# EAGLE design Adafruit 1.3in Color TFT Bonnet (EAGLE 9.5.0)
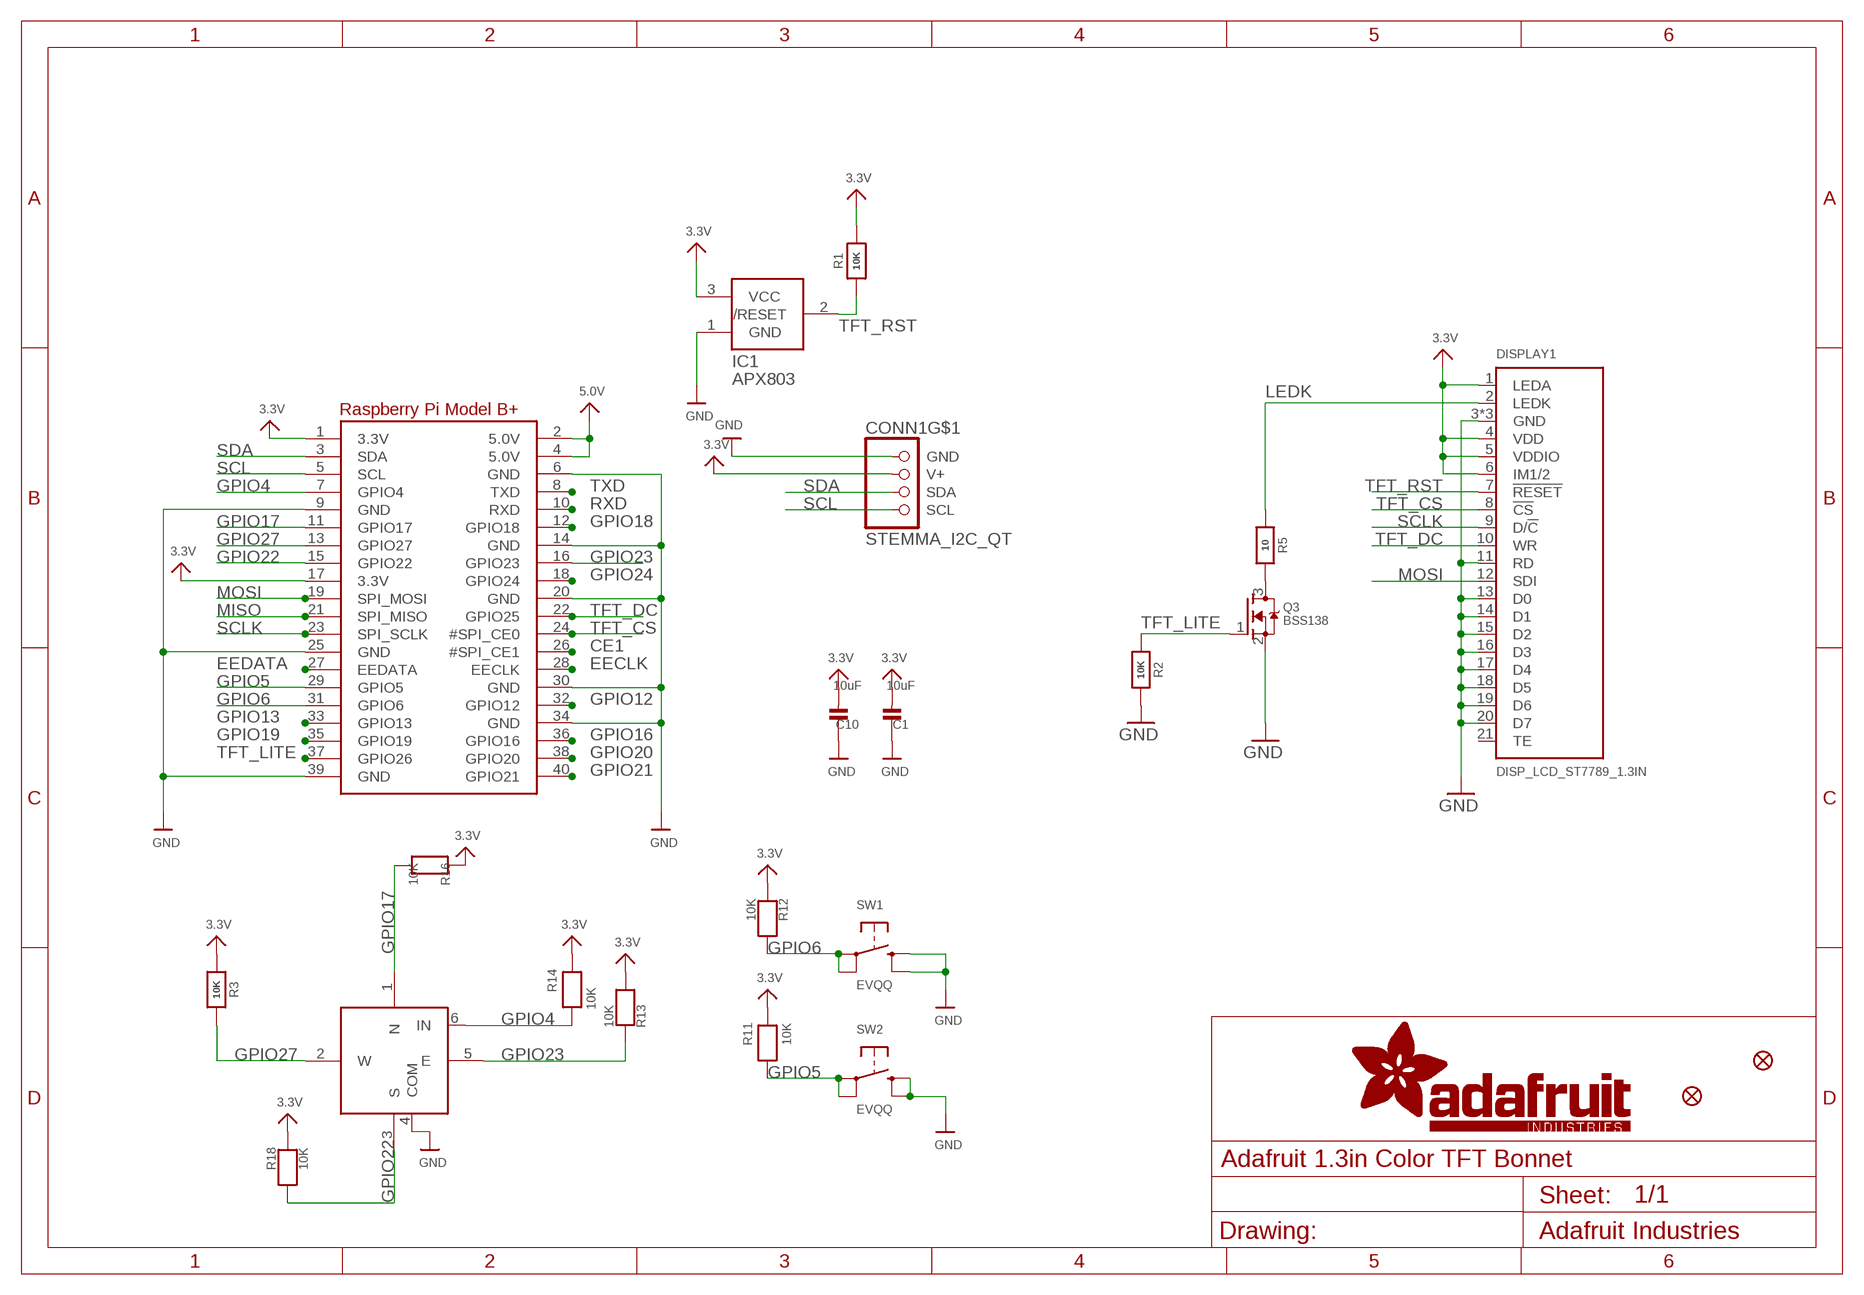
[diagram p0: schematic, sheet 1]

## Parts
C1  10uF  CAP_CERAMIC0805-NOOUTLINE  [0805-NO]
C10  10uF  CAP_CERAMIC0805-NOOUTLINE  [0805-NO]
CONN1  STEMMA_I2C_QT  [JST_SH4]
DISPLAY1  DISP_LCD_ST7789_1.3IN  [TFT_1.3IN_240X240_24P]
FID1  FIDUCIAL_1MM  [FIDUCIAL_1MM]
FID2  FIDUCIAL_1MM  [FIDUCIAL_1MM]
IC1  APX803  AXP083-SAG  [SOT23]
Q3  BSS138  MOSFET-NWIDE  [SOT23-WIDE]
R1  10K  RESISTOR0805_NOOUTLINE  [0805-NO]
R2  10K  RESISTOR_0603_NOOUT  [0603-NO]
R3  10K  RESISTOR0805_NOOUTLINE  [0805-NO]
R5  10  RESISTOR_0603_NOOUT  [0603-NO]
R11  10K  RESISTOR0805_NOOUTLINE  [0805-NO]
R12  10K  RESISTOR0805_NOOUTLINE  [0805-NO]
R13  10K  RESISTOR0805_NOOUTLINE  [0805-NO]
R14  10K  RESISTOR0805_NOOUTLINE  [0805-NO]
R16  10K  RESISTOR0805_NOOUTLINE  [0805-NO]
R18  10K  RESISTOR0805_NOOUTLINE  [0805-NO]
RPI1  RASPBERRYPI_BPLUS_BONNETSMT  [PI_BONNET_SMT]
SW1  EVQQ  SWITCH_TACT_SMT_6MM  [6MMX6MM_TACTILE_SMT]
SW2  EVQQ  SWITCH_TACT_SMT_6MMSMALL  [6MM_SMT]
SW3  NAVSWITCHSKQUABAUE010  [SKQUBAE010]

## Nets
3.3V: C1.2 C10.2 CONN1.2(V+) DISPLAY1.1(LEDA) DISPLAY1.4(VDD) DISPLAY1.5(VDDIO) DISPLAY1.6(IM1/2) IC1.3(VCC) R1.2 R3.2 R11.2 R12.2 R13.2 R14.2 R16.1 R18.1 RPI1.1(3.3V) RPI1.17(3.3V)
5.0V: RPI1.2(5.0V) RPI1.4(5.0V)
CE1: RPI1.26(#SPI_CE1)
EECLK: RPI1.28(EECLK)
EEDATA: RPI1.27(EEDATA)
GND: C1.1 C10.1 CONN1.1(GND) DISPLAY1.3(GND) DISPLAY1.11(RD) DISPLAY1.13(D0) DISPLAY1.14(D1) DISPLAY1.15(D2) DISPLAY1.16(D3) DISPLAY1.17(D4) DISPLAY1.18(D5) DISPLAY1.19(D6) DISPLAY1.20(D7) DISPLAY1.23(GND) DISPLAY1.24(GND) IC1.1(GND) Q3.2(S) R2.1 RPI1.6(GND) RPI1.9(GND) RPI1.14(GND) RPI1.20(GND) RPI1.25(GND) RPI1.30(GND) RPI1.34(GND) RPI1.39(GND) SW1.B'(S1) SW1.B(S) SW2.B'(S1) SW2.B(S) SW3.4(COM)
GPIO4: R14.1 RPI1.7(GPIO4) SW3.6(IN)
GPIO5: R11.1 RPI1.29(GPIO5) SW2.A'(P1) SW2.A(P)
GPIO6: R12.1 RPI1.31(GPIO6) SW1.A'(P1) SW1.A(P)
GPIO12: RPI1.32(GPIO12)
GPIO13: RPI1.33(GPIO13)
GPIO16: RPI1.36(GPIO16)
GPIO17: R16.2 RPI1.11(GPIO17) SW3.1(N)
GPIO18: RPI1.12(GPIO18)
GPIO19: RPI1.35(GPIO19)
GPIO20: RPI1.38(GPIO20)
GPIO21: RPI1.40(GPIO21)
GPIO22: R18.2 RPI1.15(GPIO22) SW3.3(S)
GPIO23: R13.1 RPI1.16(GPIO23) SW3.5(E)
GPIO24: RPI1.18(GPIO24)
GPIO27: R3.1 RPI1.13(GPIO27) SW3.2(W)
LEDK: DISPLAY1.2(LEDK) R5.2
MISO: RPI1.21(SPI_MISO)
MOSI: DISPLAY1.12(SDI) RPI1.19(SPI_MOSI)
N$1: Q3.3(D) R5.1
RXD: RPI1.10(RXD)
SCL: CONN1.4(SCL) RPI1.5(SCL)
SCLK: DISPLAY1.9(D/!C) RPI1.23(SPI_SCLK)
SDA: CONN1.3(SDA) RPI1.3(SDA)
TFT_CS: DISPLAY1.8(!CS) RPI1.24(#SPI_CE0)
TFT_DC: DISPLAY1.10(WR) RPI1.22(GPIO25)
TFT_LITE: Q3.1(G) R2.2 RPI1.37(GPIO26)
TFT_RST: DISPLAY1.7(!RESET) IC1.2(/RESET) R1.1
TXD: RPI1.8(TXD)
Unconnected: CONN1.MT1(MT) CONN1.MT2(MT) DISPLAY1.21(TE)

## Library data of the parts
C1 C10 = microbuilder:CAP_CERAMIC: Ceramic Capacitors For new designs, use the packages preceded by an '_' character since they are more reliable: The following footprints should be used on most boards: _0402 - Standard footprint for regular board layouts _0603 - Standard footprint for regular board layouts _0805 - Standard footprint for regular board layouts _1206 - Standard footprint for regular board layouts For extremely tight-pitch boards where space is at a premium, the following 'micro-pitch' footprints can be used (smaller pads, no silkscreen outline, etc.): _0402MP - Micro-pitch footprint for very dense/compact boards _0603MP - Micro-pitch footprint for very dense/compact boards _0805MP - Micro-pitch footprint for very dense/compact boards _1206MP - Micro-pitch footprint for very dense/compact boards
CONN1 = microbuilder:STEMMA_I2C
DISPLAY1 = adafruit_display:DISP_LCD_ST7789_1.3IN
FID1 FID2 = microbuilder:FIDUCIAL: Fiducial Alignment Points Various fiducial points for machine vision alignment.; BOM: EXCLUDE
IC1 = adafruit:AXP083
Q3 = microbuilder:MOSFET-N: N-Channel Mosfet LEGEND VDS: Voltage Drain-Source ID: Drain Current RDS(ON): Drain-Source On-State Resistance VGS(TH): Gate-Source Threshold Voltage CISS: Drain-Source Input Capacitance SOT-23 Name VDS ID RDS(ON) VGS(TH) CISS Order Number 2N7002E 60V 260mA 2.5 Ohm 2.5V @ 250uA 26.7pF @ 25V 2N7002ET1GOSTR-ND BSH103 30V 850mA 400 mOhm 400mV @ 1mA 83pF @ 24V BSH103,235-ND BSS138 60V 320mA 1.6 Ohm 1.5V @ 250uA 50pF @ 10V Mouser: 771-BSS138PW115 DMN2075U-7 20V 4.2A 38 mOhm 1V @ 250 uA 594.3pF @ 10V DMN2075U-7DICT-ND * BSS138 good choice for I2C level-shifting POWERPAK 1212-8 Name VDS ID RDS(ON) VGS(TH) CISS Order Number Si7308DN 60V 6A 58 mOhm 3V @ 250uA 665pF @ 15V SI7308DN-T1-E3CT-ND
R1-R3 R5 R11-R14 R16 R18 = microbuilder:RESISTOR: Resistors For new designs, use the packages preceded by an '_' character since they are more reliable: The following footprints should be used on most boards: _0402 - Standard footprint for regular board layouts _0603 - Standard footprint for regular board layouts _0805 - Standard footprint for regular board layouts _1206 - Standard footprint for regular board layouts For extremely tight-pitch boards where space is at a premium, the following 'micro-pitch' footprints can be used (smaller pads, no silkscreen outline, etc.): _0402MP - Micro-pitch footprint for very dense/compact boards _0603MP - Micro-pitch footprint for very dense/compact boards _0805MP - Micro-pitch footprint for very dense/compact boards _1206MP - Micro-pitch footprint for very dense/compact boards
RPI1 = adafruit_sbc:RASPBERRYPI_BPLUS
SW1 SW2 = microbuilder:SWITCH_TACT_SMT: SMT Tact Switches 6x6mm - Digikey: P12940SCT-ND KMR2 (4.6x2.8mm) - Digikey: 401-1426-1-ND EVQ-PQHB55 - Light Touch, 160GF (4.5x4.5mm) - Digikey: P8090SCT-ND KMT0 - KMT021 NGJ LHS (etc.) IP68/Waterproof - Digikey: CKN10289CT-ND
SW3 = microbuilder:NAVSWITCH

## Board
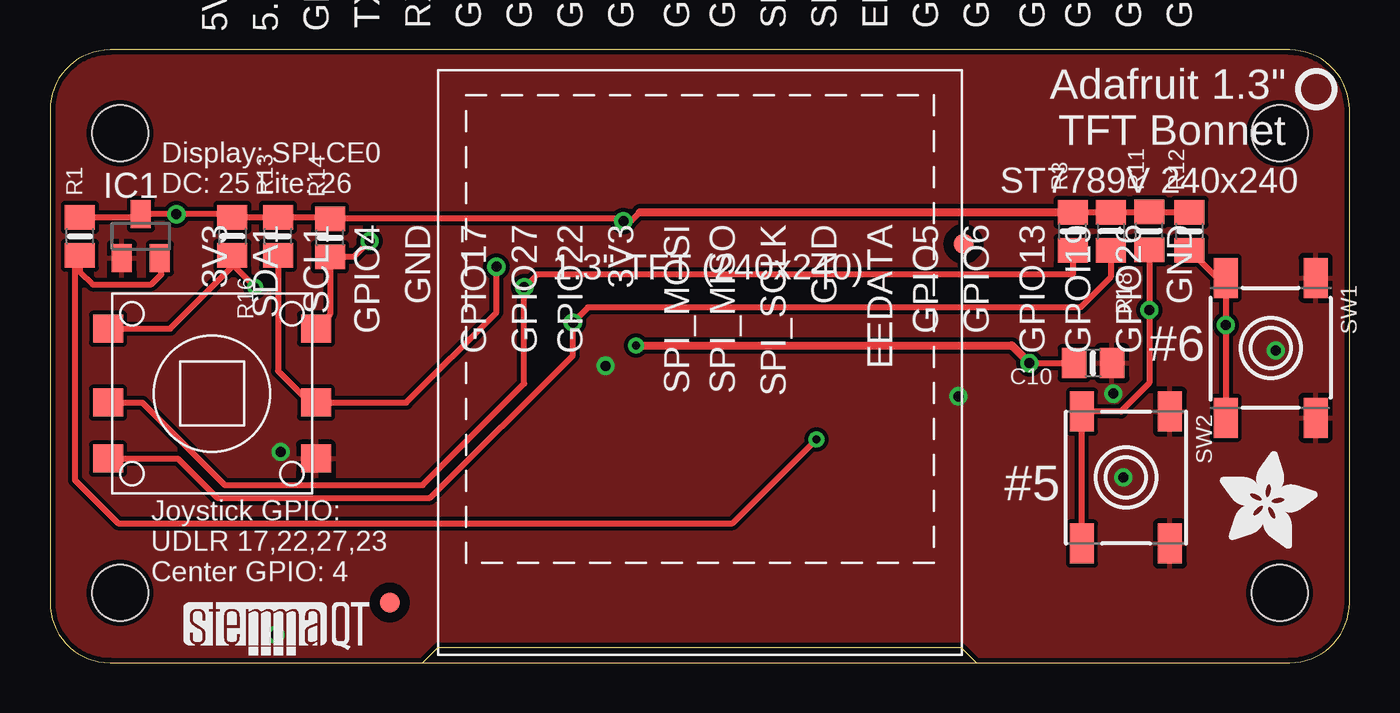
[diagram p1: board, top side]
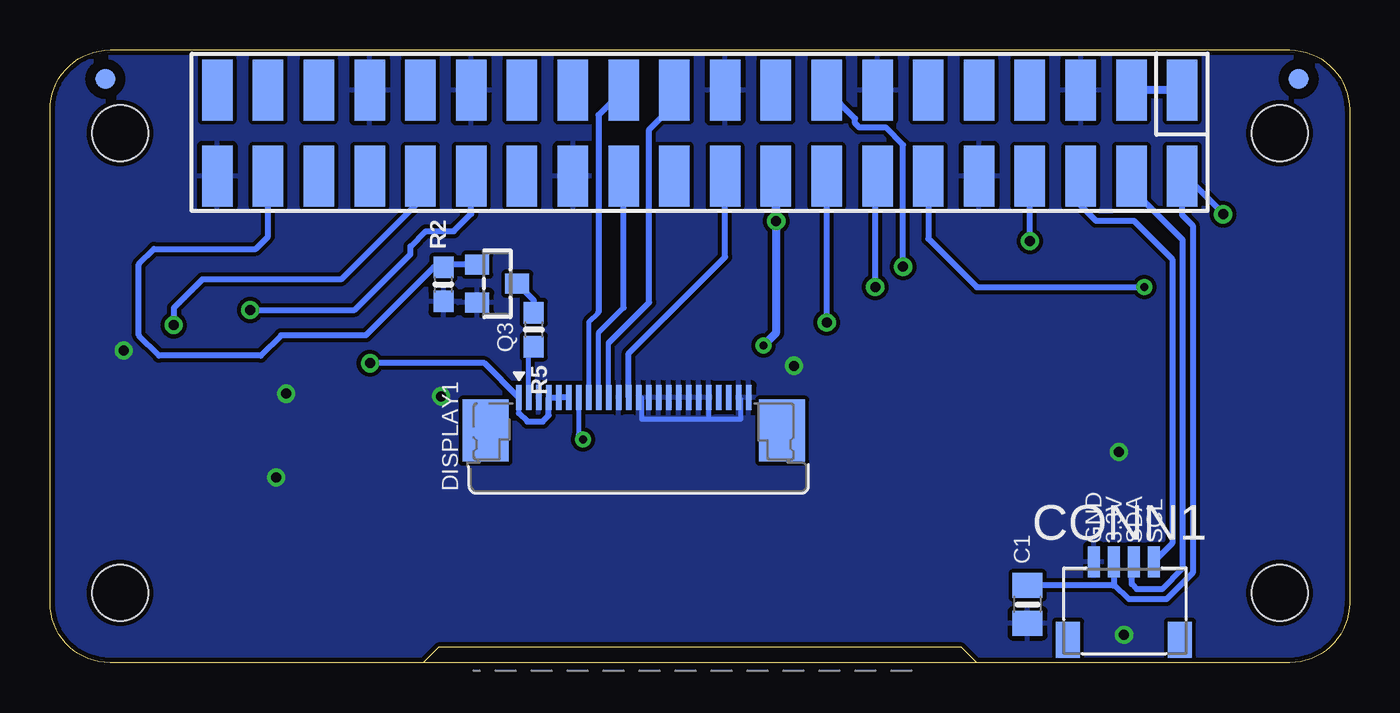
[diagram p2: board, bottom side, seen from below]

Size 65 x 30.66 mm. Coordinates in mm from the lower left corner, seen from the top.
Outline: 18.64,0 19.41,0.76 45.57,0.76 46.33,0
Copper layers (1*16): Top 0.035mm / dielectric 1.5mm / Bottom 0.035mm
Design rules "adafruit": minimum track width 8mil, minimum drill 15.5mil, track to track 8mil, track to pad 8mil, pad to pad 8mil, via to via 8mil, smd to smd 8mil, copper to edge 10mil, drill to drill 8mil, minimum pad ring 10mil, minimum via ring 8mil, stop-mask expansion 2mil, vias tented up to drill 20mil, thermal gap 10mil

### Footprints (pad centres in the part's own frame; a part is rotated, then mirrored left to right if it is on the bottom)
0805-NO = smd 1.24 x 1.5: 1 -0.95,0; 2 0.95,0
JST_SH4 = smd 0.6 x 1.55: 1 -1.5,2.514; 2 -0.5,2.514; 3 0.5,2.514; 4 1.5,2.514 | smd 1.2 x 1.8: MT1 -2.8,-1.386; MT2 2.8,-1.386
TFT_1.3IN_240X240_24P = smd 0.28 x 1.25: 1 4.55,13.378; 2 5.05,13.378; 3 5.55,13.378; 4 6.05,13.378; 5 6.55,13.378; 6 7.05,13.378; 7 7.55,13.378; 8 8.05,13.378; 9 8.55,13.378; 10 9.05,13.378; 11 9.55,13.378; 12 10.05,13.378; 13 10.55,13.378; 14 11.05,13.378; 15 11.55,13.378; 16 12.05,13.378; 17 12.55,13.378; 18 13.05,13.378; 19 13.55,13.378; 20 14.05,13.378; 21 14.55,13.378; 22 15.05,13.378; 23 15.55,13.378; 24 16.05,13.378 | smd 2.3 x 3.1: MNT1 2.88,11.722; MNT2 17.72,11.722
FIDUCIAL_1MM = smd 1 x 1: 1 0,0
SOT23 = smd 1 x 1.4: 1 -0.95,-1.1; 2 0.95,-1.1; 3 0,1.1
SOT23-WIDE = smd 1 x 1.2: 1 -0.95,-1; 2 0.95,-1; 3 0,1
0603-NO = smd 1.075 x 1: 1 -0.85,0; 2 0.85,0
PI_BONNET_SMT = smd 1.524 x 3.048 bottom: 1 8.37,24.339; 2 8.37,28.657; 3 10.91,24.339; 4 10.91,28.657; 5 13.45,24.339; 6 13.45,28.657; 7 15.99,24.339; 8 15.99,28.657; 9 18.53,24.339; 10 18.53,28.657; 11 21.07,24.339; 12 21.07,28.657; 13 23.61,24.339; 14 23.61,28.657; 15 26.15,24.339; 16 26.15,28.657; 17 28.69,24.339; 18 28.69,28.657; 19 31.23,24.339; 20 31.23,28.657; 21 33.77,24.339; 22 33.77,28.657; 23 36.31,24.339; 24 36.31,28.657; 25 38.85,24.339; 26 38.85,28.657; 27 41.39,24.339; 28 41.39,28.657; 29 43.93,24.339; 30 43.93,28.657; 31 46.47,24.339; 32 46.47,28.657; 33 49.01,24.339; 34 49.01,28.657; 35 51.55,24.339; 36 51.55,28.657; 37 54.09,24.339; 38 54.09,28.657; 39 56.63,24.339; 40 56.63,28.657 | smd 1 x 1 bottom: 41 2.54,29.21; 42 62.23,29.21 | hole 2.8: 3.5,3.5; 3.5,26.5; 61.5,26.5; 61.5,3.5
6MMX6MM_TACTILE_SMT = smd 2 x 1.2: A -3.5,-2.25; A' 3.5,-2.25; B -3.5,2.25; B' 3.5,2.25
6MM_SMT = smd 2 x 1.2: A -3.3,-2.2; A' 3.3,-2.2; B -3.3,2.2; B' 3.3,2.2
SKQUBAE010 = smd 1.5 x 1.4: 1 -5.2,3.25; 2 -5.2,-0.45; 3 -5.2,-3.25; 4 5.2,-3.25; 5 5.2,-0.45; 6 5.2,3.25

### Placement (x,y rotation side)
C1  16.1,2.92 90 bottom
C10  52.17,14.99 180 top
CONN1  11.28,2.54 0 bottom
DISPLAY1  46.1,-0.11 0 bottom
FID1  45.69,20.95 0 top
FID2  17,3.01 0 top
IC1  4.55,21.34 0 top
Q3  42.63,18.97 270 bottom
R1  1.5,21.34 90 top
R2  45.31,18.92 90 bottom
R3  51.16,21.59 90 top
R5  40.81,16.67 270 bottom
R11  54.98,21.61 90 top
R12  57,21.59 90 top
R13  11.4,21.34 90 top
R14  14,21.26 90 top
R16  9.12,21.34 270 top
R18  53.06,21.59 270 top
RPI1  0,0 0 top
SW1  61.06,15.75 270 top
SW2  53.82,9.27 270 top
SW3  8.1,13.46 0 top
U$2  [PCBFEAT-REV-040]  63.35,28.7 0 top
U$28  [ADAFRUIT_5MM]  58.52,5.71 0 top
U$29  [STEMMAQT]  6.71,0.38 0 top

### Tracks (layer width: path | path; a pad name or v marks a point on that pad's centre or on a via)
3.3V  (via drill 0.39, 0.5)
  Top 0.305: R1.2 4.4,22.29 IC1.3 v6.32,22.44 8.97,22.44 R16.1 R13.2 13.93,22.29 R14.2 28.31,22.21 28.42,22.1 v28.68,22.1 | R3.2 R18.1 54.96,22.54 R11.2 56.98,22.56 R12.2 | v49,14.99 C10.2 | v28.68,22.1 | 29.5,22.54 29.06,22.1 v28.68,22.1
  Top 0.406: v29.31,15.88 48.11,15.88 v49,14.99 | 29.5,22.54 R3.2
  Bottom 0.254: DISPLAY1.1 41.55,12.49
  Bottom 0.305: DISPLAY1.6 DISPLAY1.5 DISPLAY1.4 40.05,12.37 40.36,12.06 41.12,12.06 41.55,12.49 | DISPLAY1.1 43.27,14.99 v49,14.99 | CONN1.2 11.78,3.93 | 11.78,3.93 11.02,3.17 9.16,3.17 7.85,4.49 7.85,21.88 8.37,22.41 RPI1.1 8.37,24.51 6.32,22.47 v6.32,22.44 | 28.69,22.73 28.69,22.11 v28.68,22.1 | 11.78,3.93 11.84,3.87 C1.2
  Bottom 0.406: RPI1.17 28.69,22.73 28.69,16.5 v29.31,15.88
5.0V
  Bottom 0.305: RPI1.4 10.91,27.77 RPI1.4 | RPI1.2 8.37,27.77 RPI1.2
  Bottom 0.406: RPI1.2 RPI1.4
CE1
  Bottom 0.305: RPI1.26 38.85,27.77 RPI1.26
EECLK
  Bottom 0.305: RPI1.28 41.39,27.77 RPI1.28
EEDATA
  Bottom 0.305: RPI1.27 41.39,25.23 RPI1.27
GND  (via drill 0.5)
  Bottom 0.254: DISPLAY1.20 32.05,12.19 | DISPLAY1.23 30.45,13.17 30.45,12.19 32.05,12.19 | DISPLAY1.13 35.41,13.27 35.41,12.19 32.05,12.19
  Bottom 0.305: 23.61,27.77 RPI1.14 | 31.23,27.77 RPI1.20 | 56.63,25.23 RPI1.39 | 49.01,27.77 RPI1.34 | 43.93,27.77 RPI1.30
  other vias: 11.53,10.54 11.28,1.4 27.79,14.86 45.44,13.34 53.7,9.27 61.32,15.62 53.19,13.46
  pour Top: 0.1,0 65,0 65,30.61 0.1,30.61
  pour Bottom: 0.1,0 65,0 65,30.61 0.1,30.61
GPIO4  (via drill 0.5)
  Top 0.305: SW3.6 14,17.41 R14.1 15.21,20.31 v15.99,21.09
  Bottom 0.254: 15.99,24.64 RPI1.7
  Bottom 0.305: v15.99,21.09 15.99,24.64 | 15.99,24.64
GPIO5  (via drill 0.5)
  Top 0.305: R11.1 v54.98,17.65 54.98,13.99 53.57,12.58 53.57,12.57 SW2.A SW2.A'
  Bottom 0.305: v54.98,17.65 49.76,17.65 46.96,20.45 46.96,20.83 46.2,21.59 44.81,21.59 43.93,22.47 RPI1.29
GPIO6  (via drill 0.5)
  Top 0.305: R12.1 58.79,18.85 SW1.A v58.81,16.89 | v58.81,16.89 | v58.81,16.89 SW1.A'
  Bottom 0.305: RPI1.31 46.47,23.15 50.44,19.18 57.38,19.18 58.81,17.75 v58.81,16.89
GPIO12
  Bottom 0.305: RPI1.32 46.47,27.77 RPI1.32
GPIO13
  Bottom 0.305: RPI1.33 49.01,25.23 RPI1.33
GPIO16
  Bottom 0.305: RPI1.36 51.55,27.77 RPI1.36
GPIO17  (via drill 0.39)
  Top 0.305: SW3.1 6.02,16.71 9.12,19.81 R16.2 9.12,19.94 v10.26,18.8
  Bottom 0.305: RPI1.11 21.07,25.23 RPI1.11 | RPI1.11 21.07,21.22 18.64,18.8 v10.26,18.8
GPIO18
  Bottom 0.203: RPI1.12
  Bottom 0.305: RPI1.12
GPIO19
  Bottom 0.305: RPI1.35 51.55,25.23 RPI1.35
GPIO20
  Bottom 0.305: RPI1.38 54.09,27.77 RPI1.38
GPIO21
  Bottom 0.305: RPI1.40 56.63,27.77 RPI1.40
GPIO22  (via drill 0.5)
  Top 0.305: SW3.3 6.4,10.21 8.36,8.26 19.02,8.26 26.15,15.38 v26.15,17.02 26.91,17.78 51.54,17.78 53.06,19.3 R18.2
  Bottom 0.305: v26.15,17.02 | v26.15,17.02 RPI1.15
GPIO23  (via drill 0.5)
  Top 0.305: R13.1 11.4,14.61 13,13.01 SW3.5 17.81,13.01 22.33,17.53 v22.33,19.81
  Bottom 0.305: v22.33,19.81 22.33,25.91 23.2,26.78 24.52,26.78 24.73,26.99 24.73,27.23 RPI1.16
GPIO24
  Bottom 0.254: RPI1.18 | RPI1.18
GPIO27  (via drill 0.5)
  Top 0.305: SW3.2 4.62,13.01 8.74,8.89 18.64,8.89 23.72,13.97 v23.72,18.8 24.36,19.43 51.16,19.43 R3.1
  Bottom 0.305: v23.72,18.8 23.72,24.23 RPI1.13
LEDK
  Bottom 0.254: DISPLAY1.2 41.05,15.58
  Bottom 0.305: 41.05,15.58 R5.2
MISO
  Bottom 0.305: RPI1.21 33.77,25.23 RPI1.21
MOSI
  Bottom 0.305: DISPLAY1.12 36.05,15.48 31.23,20.31 RPI1.19 31.23,25.23
N$1
  Bottom 0.305: Q3.3 40.81,18.14 R5.1
RXD
  Bottom 0.203: RPI1.10
  Bottom 0.305: RPI1.10
SCL
  Bottom 0.305: RPI1.5 13.45,25.23 RPI1.5 | RPI1.5 13.45,22.87 12.67,22.1 10.77,22.1 8.86,20.19 8.86,5.97 CONN1.4
SCLK
  Bottom 0.254: DISPLAY1.9 37.55,16.52 36.31,17.77
  Bottom 0.305: 36.31,17.77 RPI1.23 36.31,25.23
SDA
  Bottom 0.305: RPI1.3 10.91,25.23 RPI1.3 | RPI1.3 10.91,23.72 8.36,21.16 8.36,4.7 9.37,3.68 10.64,3.68 10.9,3.94 10.9,4.93 CONN1.3
TFT_CS
  Bottom 0.254: 37.57,17.53 38.05,17.04 DISPLAY1.8
  Bottom 0.305: 36.31,27.77 RPI1.24 37.57,27.4 37.57,17.53
TFT_DC
  Bottom 0.203: RPI1.22
  Bottom 0.254: DISPLAY1.10 37.05,16.01
  Bottom 0.305: 33.77,27.94 RPI1.22 33.77,27.94 | 33.77,27.94 35.03,26.68 35.03,18.03 37.05,16.01
TFT_LITE
  Bottom 0.305: Q3.1 45.17,19.92 R2.2 45.82,19.77 49.21,16.38 53.44,16.38 54.46,15.37 59.54,15.37 60.55,16.38 60.55,19.94 59.79,20.7 54.71,20.7 54.09,21.32 RPI1.37
TFT_RST  (via drill 0.39)
  Top 0.305: 1.5,19.56 1.24,19.81 1.24,9.14 3.4,6.99 34.14,6.99 v38.33,11.18 | IC1.2 5.54,20.19 5.56,20.19 5.56,19.43 5.05,18.92 2.13,18.92 1.5,19.56 | R1.1 1.5,19.56
  Bottom 0.254: DISPLAY1.7 38.55,11.4
  Bottom 0.305: 38.55,11.4 v38.33,11.18
TXD
  Bottom 0.203: RPI1.8
  Bottom 0.305: RPI1.8

### Text on the board
tPlace: Adafruit 1.3" / TFT Bonnet | Display: SPI CE0 / DC: 25 Lite: 26 | ST7789V 240x240 | #6 | #5 | Joystick GPIO: / UDLR 17,22,27,23 / Center GPIO: 4
bPlace: SCL | SDA | 3.3V | GND